# EAGLE design R2020Interface (EAGLE 6.3)
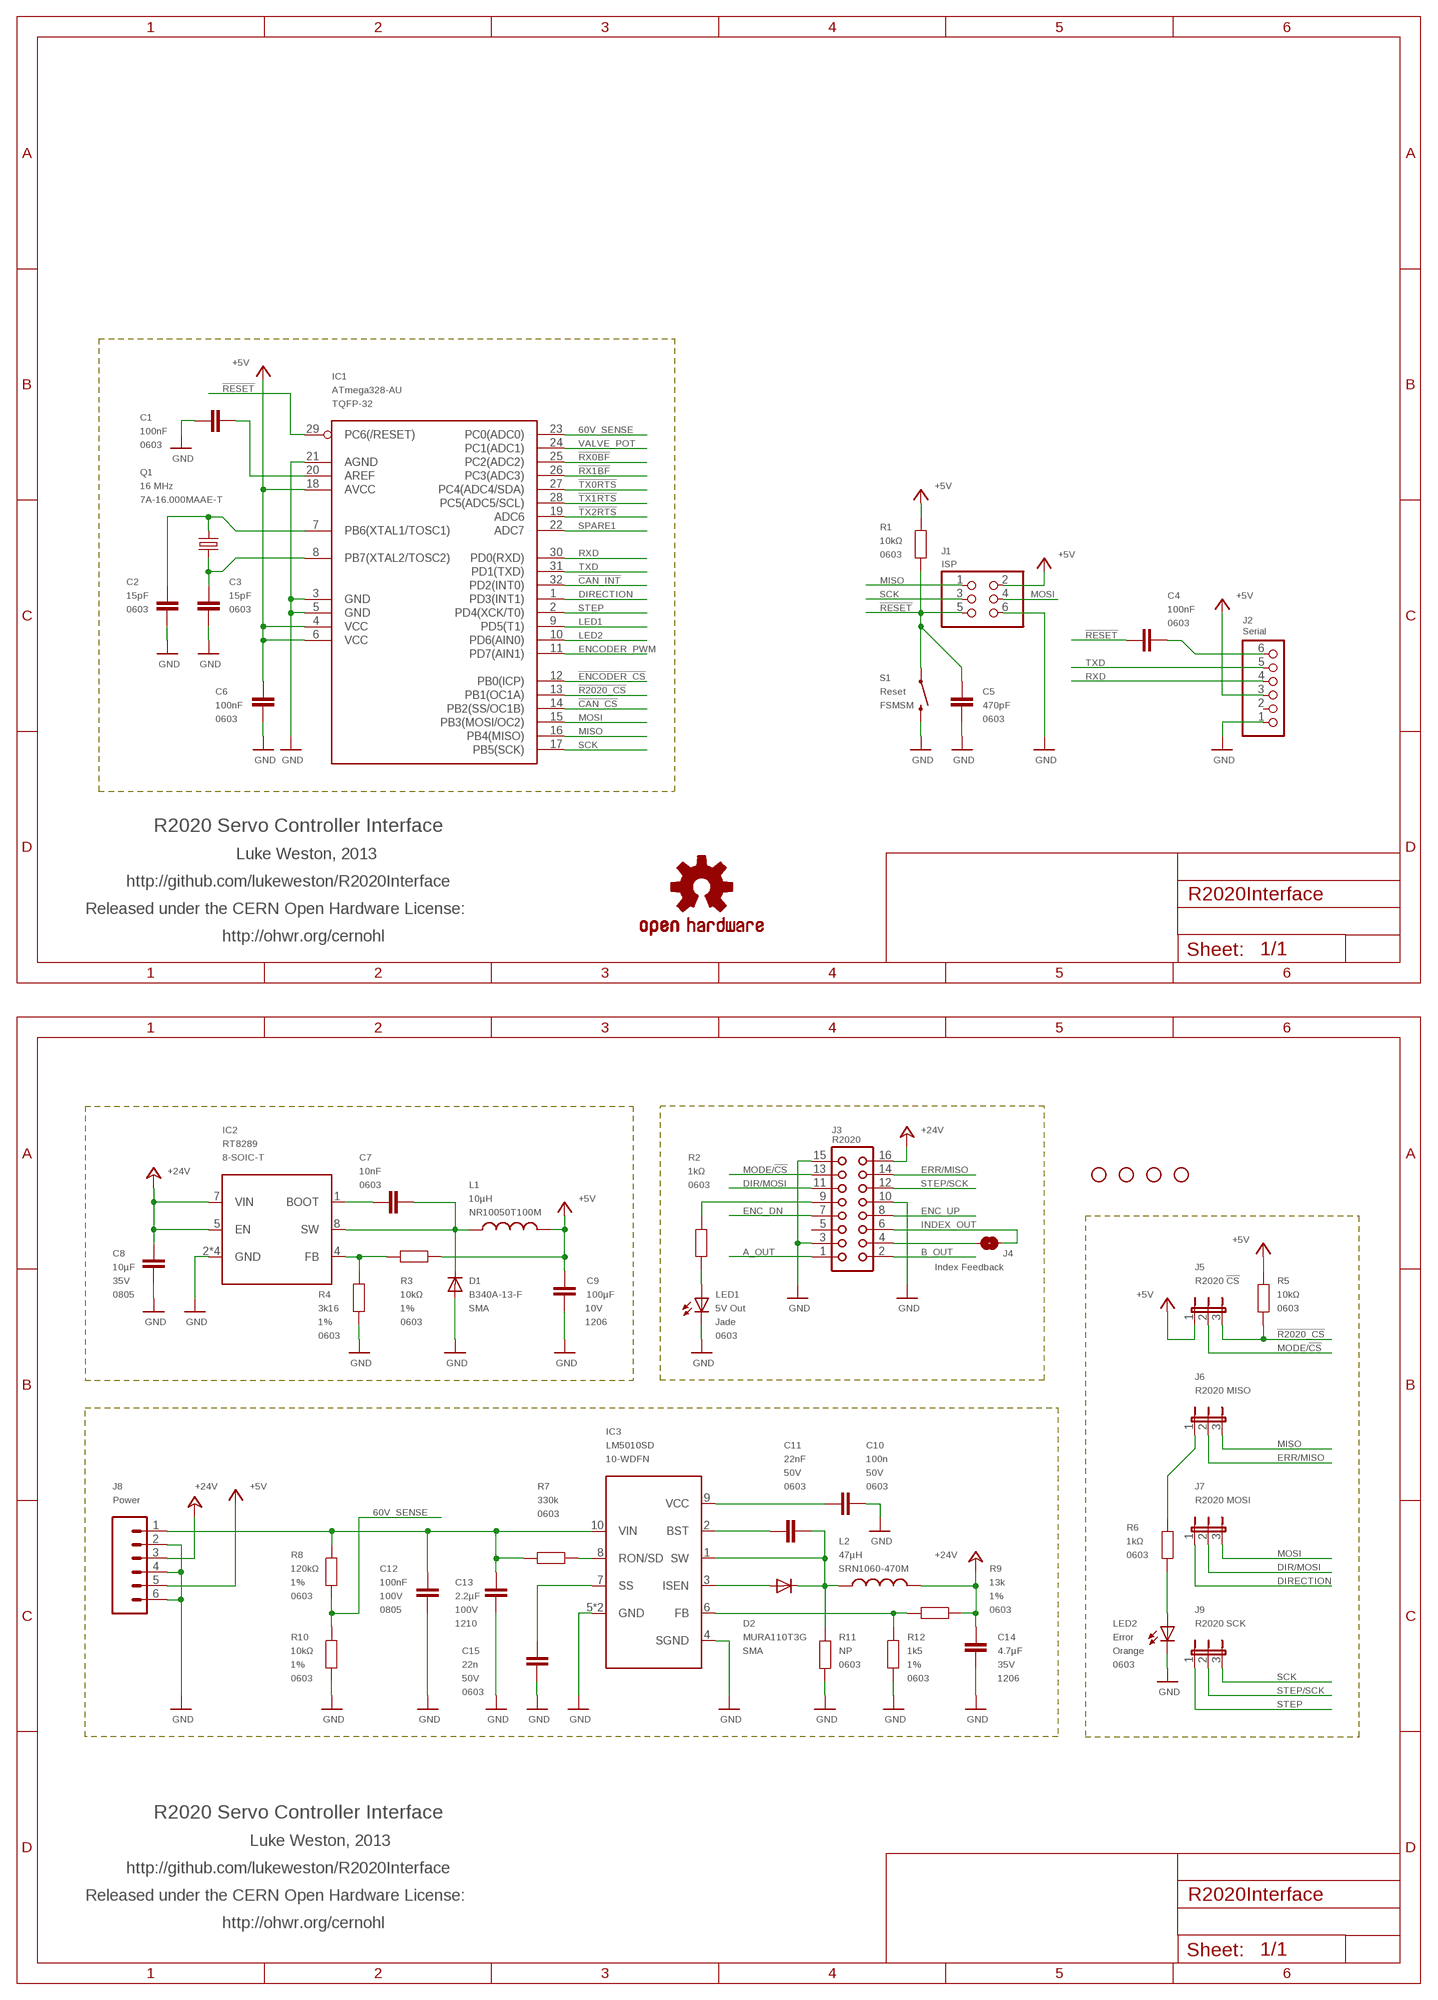
[diagram p0: schematic, sheet 1, part 1 of 2]
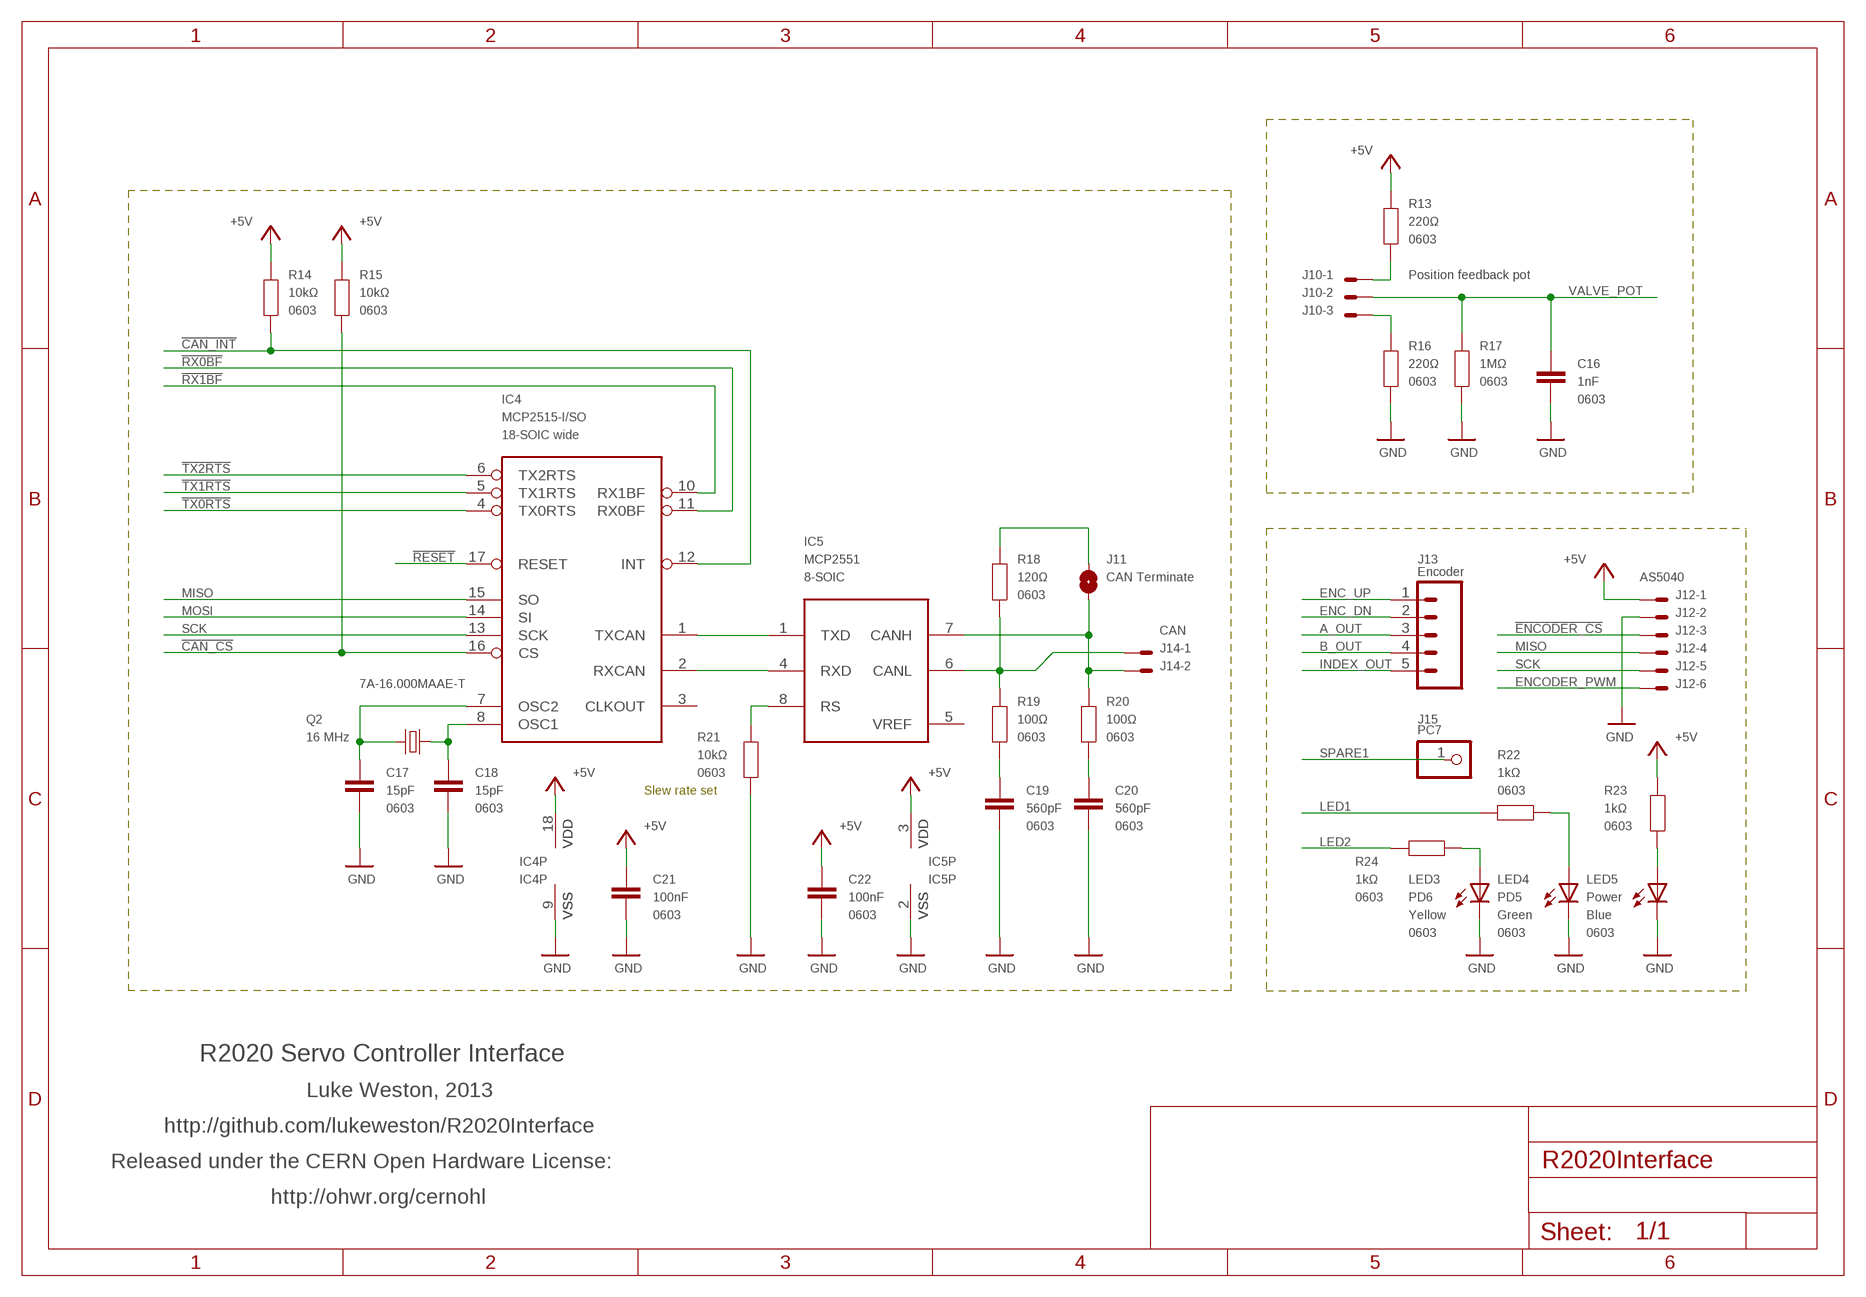
[diagram p1: schematic, sheet 1, part 2 of 2]

## Parts
C1  100nF  CAP0603  [0603]
C2  15pF  CAP0603  [0603]
C3  15pF  CAP0603  [0603]
C4  100nF  CAP0603  [0603]
C5  470pF  CAP0603  [0603]
C6  100nF  CAP0603  [0603]
C7  10nF  CAP0603  [0603]
C8  10µF  CAP0805  [0805]
C9  100µF  C-EUC1206K  [C1206K]
C10  100n  CAP0603  [0603]
C11  22nF  CAP0603  [0603]
C12  100nF  CAP0805  [0805]
C13  2.2µF  C-EUC1210K  [C1210K]
C14  4.7µF  C-EUC1206K  [C1206K]
C15  22n  CAP0603  [0603]
C16  1nF  CAP0603  [0603]
C17  15pF  CAP0603  [0603]
C18  15pF  CAP0603  [0603]
C19  560pF  CAP0603  [0603]
C20  560pF  CAP0603  [0603]
C21  100nF  CAP0603  [0603]
C22  100nF  CAP0603  [0603]
D1  B340A-13-F  DIODESMA  [SMA-DIODE]
D2  MURA110T3G  DIODESMA  [SMA-DIODE]
IC1  ATmega328-AU  AVR-MEGA8-AI  [TQFP32-08]
IC2  RT8289  [SO08T]
IC3  LM5010SD  LM5010  [10-WSON]
IC4  MCP2515-I/SO  MCP2510SO  [SO-18W]
IC5  MCP2551  MCP2551SN  [SO-08]
J1  ISP  PINHD-2X3  [2X03]
J2  Serial  PINHD-1X6  [1X06]
J3  R2020  CON16  [CON16]
J4  Index Feedback  SJ  [SJ]
J5  R2020 !CS  JP2E  [JP2]
J6  R2020 MISO  JP2E  [JP2]
J7  R2020 MOSI  JP2E  [JP2]
J8  Power  M06  [TERMINALBLOCK_3.5MM_6]
J9  R2020 SCK  JP2E  [JP2]
J10  Position feedback pot  22-05-7038-03  [7395-03]
J11  CAN Terminate  SJ  [SJ]
J12  AS5040  22-05-7068-06  [7395-06]
J13  Encoder  M05PTH  [1X05]
J14  CAN  22-05-7028-02  [7395-02]
J15  PC7  PINHD-1X1  [1X01]
JP1  STAND-OFF  [STAND-OFF]
JP2  STAND-OFF  [STAND-OFF]
JP3  STAND-OFF  [STAND-OFF]
JP4  STAND-OFF  [STAND-OFF]
L1  10µH  NR10050  [NR10050]
L2  47µH  SRN1060  [SRN1060]
LED1  5V Out  LED0603  [LED-0603]
LED2  Error  LED0603  [LED-0603]
LED3  PD6  LED0603  [LED-0603]
LED4  PD5  LED0603  [LED-0603]
LED5  Power  LED0603  [LED-0603]
Q1  16 MHz  CRYSTAL-2LEAD3.2X5  [CRYSTAL-3.2X5MM]
Q2  16 MHz  CRYSTAL-2LEAD3.2X5  [CRYSTAL-3.2X5MM]
R1  10kΩ  RESISTOR0603  [0603]
R2  1kΩ  RESISTOR0603  [0603]
R3  10kΩ  RESISTOR0603  [0603]
R4  3k16  RESISTOR0603  [0603]
R5  10kΩ  RESISTOR0603  [0603]
R6  1kΩ  RESISTOR0603  [0603]
R7  330k  RESISTOR0603  [0603]
R8  120kΩ  RESISTOR0603  [0603]
R9  13k  RESISTOR0603  [0603]
R10  10kΩ  RESISTOR0603  [0603]
R11  NP  RESISTOR0603  [0603]
R12  1k5  RESISTOR0603  [0603]
R13  220Ω  RESISTOR0603  [0603]
R14  10kΩ  RESISTOR0603  [0603]
R15  10kΩ  RESISTOR0603  [0603]
R16  220Ω  RESISTOR0603  [0603]
R17  1MΩ  RESISTOR0603  [0603]
R18  120Ω  RESISTOR0603  [0603]
R19  100Ω  RESISTOR0603  [0603]
R20  100Ω  RESISTOR0603  [0603]
R21  10kΩ  RESISTOR0603  [0603]
R22  1kΩ  RESISTOR0603  [0603]
R23  1kΩ  RESISTOR0603  [0603]
R24  1kΩ  RESISTOR0603  [0603]
S1  Reset  FSMSM  [FSMSM]
SY1  OSHW-LOGOS  [OSHW-LOGO-S]

## Nets
60V_SENSE: IC1.23(PC0(ADC0)) R8.1 R10.2
!CAN_CS: IC1.14(PB2(SS/OC1B)) IC4.16(CS) R15.2
!CAN_INT: IC1.32(PD2(INT0)) IC4.12(INT) R14.2
!ENCODER_CS: IC1.12(PB0(ICP)) J12.3
!R2020_CS: IC1.13(PB1(OC1A)) J5.3 R5.2
!RESET: C4.1 C5.2 IC1.29(PC6(/RESET)) IC4.17(RESET) J1.5 R1.1 S1.1
!RX0BF: IC1.25(PC2(ADC2)) IC4.11(RX0BF)
!RX1BF: IC1.26(PC3(ADC3)) IC4.10(RX1BF)
!TX0RTS: IC1.27(PC4(ADC4/SDA)) IC4.4(TX0RTS)
!TX1RTS: IC1.28(PC5(ADC5/SCL)) IC4.5(TX1RTS)
!TX2RTS: IC1.19(ADC6) IC4.6(TX2RTS)
+5V: C6.1 C9.1 C21.2 C22.2 IC1.4(VCC) IC1.6(VCC) IC1.18(AVCC) IC4.18(VDD) IC5.3(VDD) J1.2 J2.3 J5.1 J8.5 J12.1 L1.2 R1.2 R3.1 R5.1 R13.1 R14.1 R15.1 R23.1
+24V: C8.2 C14.1 IC2.5(EN) IC2.7(VIN) J3.16 J8.3 L2.2 R9.1
A_OUT: J3.1 J13.3
B_OUT: J3.2 J13.4
DIR/MOSI: J3.11 J7.2
DIRECTION: IC1.1(PD3(INT1)) J7.1
ENC_DN: J3.7 J13.2
ENC_UP: J3.8 J13.1
ENCODER_PWM: IC1.11(PD7(AIN1)) J12.6
ERR/MISO: J3.14 J6.2
GND: C1.2 C2.1 C3.1 C5.1 C6.2 C8.1 C9.2 C10.1 C12.1 C13.2 C14.2 C15.1 C16.1 C17.1 C18.1 C19.1 C20.1 C21.1 C22.1 D1.A IC1.3(GND) IC1.5(GND) IC1.21(AGND) IC2.2(GND) IC2.3(GND) IC2.6(GND) IC2.PAD(GND) IC3.4(SGND) IC3.5(GND) IC3.PAD(GND) IC4.9(VSS) IC5.2(VSS) J1.6 J2.1 J3.3 J3.10 J3.15 J8.2 J8.4 J8.6 J12.2 LED1.C LED2.C LED3.C LED4.C LED5.C R4.1 R10.1 R11.2 R12.1 R16.2 R17.2 R21.2 S1.2
INDEX_IN: J3.4 J4.2
INDEX_OUT: J3.6 J4.1 J13.5
LED1: IC1.9(PD5(T1)) R22.2
LED2: IC1.10(PD6(AIN0)) R24.2
MISO: IC1.16(PB4(MISO)) IC4.15(SO) J1.1 J6.3 J12.4
MODE/!CS: J3.13 J5.2
MOSI: IC1.15(PB3(MOSI/OC2)) IC4.14(SI) J1.4 J7.3
N$1: C1.1 IC1.20(AREF)
N$2: C2.2 IC1.7(PB6(XTAL1/TOSC1)) Q1.1
N$3: C3.2 IC1.8(PB7(XTAL2/TOSC2)) Q1.2
N$4: LED1.A R2.1
N$5: J3.9 R2.2
N$6: J10.1 R13.2
N$7: J6.1 R6.1
N$8: J11.2 R18.1
N$9: J10.3 R16.1
N$10: LED2.A R6.2
N$11: C7.1 D1.C IC2.8(SW) L1.1
N$12: IC5.7(CANH) J11.1 J14.2 R20.1
N$13: LED3.A R24.1
N$14: IC2.4(FB) R3.2 R4.2
N$15: LED4.A R22.1
N$16: C7.2 IC2.1(BOOT)
N$17: C11.1 D2.C IC3.1(SW) L2.1 R11.1
N$18: IC5.8(RS) R21.1
N$19: D2.A IC3.3(ISEN)
N$20: IC3.6(FB) R9.2 R12.2
N$21: C15.2 IC3.7(SS)
N$22: IC3.8(RON/SD) R7.1
N$23: IC4.2(RXCAN) IC5.4(RXD)
N$24: IC4.1(TXCAN) IC5.1(TXD)
N$25: C10.2 IC3.9(VCC)
N$26: C4.2 J2.6
N$27: C11.2 IC3.2(BST)
N$28: LED5.A R23.2
N$31: C19.2 R19.2
N$32: C20.2 R20.2
N$34: IC5.6(CANL) J14.1 R18.2 R19.1
N$36: C12.2 C13.1 IC3.10(VIN) J8.1 R7.2 R8.2
N$49: C18.2 IC4.8(OSC1) Q2.1
N$50: C17.2 IC4.7(OSC2) Q2.2
RXD: IC1.30(PD0(RXD)) J2.4
SCK: IC1.17(PB5(SCK)) IC4.13(SCK) J1.3 J9.3 J12.5
SPARE1: IC1.22(ADC7) J15.1
STEP: IC1.2(PD4(XCK/T0)) J9.1
STEP/SCK: J3.12 J9.2
TXD: IC1.31(PD1(TXD)) J2.5
VALVE_POT: C16.2 IC1.24(PC1(ADC1)) J10.2 R17.1
Unconnected: IC4.3(CLKOUT) J2.2 J3.5

## Notes on the sheet
- R2020 Servo Controller Interface
- Luke Weston, 2013
- http://github.com/lukeweston/R2020Interface
- Released under the CERN Open Hardware License:
- http://ohwr.org/cernohl
- R2020 Servo Controller Interface
- Luke Weston, 2013
- http://github.com/lukeweston/R2020Interface
- Released under the CERN Open Hardware License:
- http://ohwr.org/cernohl
- Slew rate set
- R2020 Servo Controller Interface
- Luke Weston, 2013
- http://github.com/lukeweston/R2020Interface
- Released under the CERN Open Hardware License:
- http://ohwr.org/cernohl

## Power pins joined to a net without a drawn wire
VREF: IC5.5(VREF)

## Library data of the parts
C1-C7 C16-C22 = freetronics-master-v1:CAP: Capacitor Standard 0603 ceramic capacitor, and 0.1" leaded capacitor.; PACKAGE: 0603
C8 = freetronics-master-v1:CAP: Capacitor Standard 0603 ceramic capacitor, and 0.1" leaded capacitor.; PACKAGE: 0805; VOLTAGE: 35V
C9 = rcl:C-EU: CAPACITOR, European symbol; PACKAGE: 1206; VOLTAGE: 10V
C10 C11 C15 = freetronics-master-v1:CAP: Capacitor Standard 0603 ceramic capacitor, and 0.1" leaded capacitor.; PACKAGE: 0603; VOLTAGE: 50V
C12 = freetronics-master-v1:CAP: Capacitor Standard 0603 ceramic capacitor, and 0.1" leaded capacitor.; PACKAGE: 0805; VOLTAGE: 100V
C13 = rcl:C-EU: CAPACITOR, European symbol; PACKAGE: 1210; VOLTAGE: 100V
C14 = rcl:C-EU: CAPACITOR, European symbol; PACKAGE: 1206; VOLTAGE: 35V
D1 D2 = freetronics-master-v1:DIODE: Diode These are standard reverse protection diodes and small signal diodes. SMA package can handle up to about 1A. SOD-323 can handle about 200mA. What the SOD-323 package when ordering, there are some mfgs out there that are 5-pin packages.; PACKAGE: SMA
IC1 = freetronics-master-v1:AVR-MEGA8: MICROCONTROLLER 8 Kbytes FLASH 1 kbytes SRAM 512 bytes EEPROM USART 6-channel 10 bit ADC 2-channel 8 bit ADC; PACKAGE: TQFP-32
IC2 = freetronics-luke:RT8289: RT8289 buck regulator; PACKAGE: 8-SOIC-T
IC3 = freetronics-luke:LM5010: Texas Instruments LM5010 high-voltage-input buck converter; PACKAGE: 10-WDFN
IC4 = microchip_can:MCP2510; PACKAGE: 18-SOIC wide
IC5 = microchip_can:MCP2551: High Speed CAN tranceiver; PACKAGE: 8-SOIC
J1 = pinhead:PINHD-2X3: PIN HEADER
J2 = pinhead:PINHD-1X6: PIN HEADER
J3 = con-harting:CON16: CONNECTOR; OC_FARNELL: unknown; OC_NEWARK: unknown
J4 J11 = freetronics-luke:SJ: PCB "solder jumper". Note that there should nothing on the BOM corresponding to this "component".
J5-J7 J9 = jumper:JP2E: JUMPER
J8 = freetronics-master-v1:M06: Header 6 Standard 6-pin 0.1" header. Use with straight break away headers (SKU : PRT-00116), right angle break away headers (PRT-00553), swiss pins (PRT-00743), machine pins (PRT-00117), and female headers (PRT-00115). Molex polarized connector foot print use with SKU : PRT-08094 with associated crimp pins and housings. NOTES ON THE VARIANTS LOCK and LOCK_LONGPADS... This footprint was designed to help hold the alignment of a through-hole component (i.e. 6-pin header) while soldering it into place. You may notice that each hole has been shifted either up or down by 0.005 of an inch from it's more standard position (which is a perfectly straight line). This slight alteration caused the pins (the squares in the middle) to touch the edges of the holes. Because they are alternating, it causes a "brace" to hold the component in place. 0.005 has proven to be the perfect amount of "off-center" position when using our standard breakaway headers. Although looks a little odd when you look at the bare footprint, once you have a header in there, the alteration is very hard to notice. Also, if you push a header all the way into place, it is covered up entirely on the bottom side. This idea of altering the position of holes to aid alignment will be further integrated into the Sparkfun Library for other footprints. It can help hold any component with 3 or more connection pins.
J10 = con-molex:22-?-03: CONNECTOR wire to board 2.54 mm (.1 inch) pitch header; OC_FARNELL: unknown; OC_NEWARK: unknown
J12 = con-molex:22-?-06: CONNECTOR wire to board 2.54 mm (.1 inch) pitch header; OC_FARNELL: unknown; OC_NEWARK: unknown
J13 = freetronics-master-v1:M05: Header 5 Standard 5-pin 0.1" header. Use with straight break away headers (SKU : PRT-00116), right angle break away headers (PRT-00553), swiss pins (PRT-00743), machine pins (PRT-00117), and female headers (PRT-00115). Molex polarized connector foot print use with SKU : PRT-08230 with associated crimp pins and housings.
J14 = con-molex:22-?-02: CONNECTOR wire to board 2.54 mm (.1 inch) pitch header; OC_FARNELL: 9731601; OC_NEWARK: unknown
J15 = pinhead:PINHD-1X1: PIN HEADER
JP1-JP4 = SparkFun:STAND-OFF: Stand Off This is the mechanical footprint for a #4 phillips button head screw. Use the keepout ring to avoid running the screw head into surrounding components. SKU : PRT-00447
L1 = freetronics-luke:NR10050: Taiyo Yuden NR10050 SMD power inductors; ID: NR10050T100M
L2 = freetronics-luke:SRN1060: Bourns SRN1060 series SMD power inductors; ID: SRN1060-470M
LED1 = freetronics-master-v1:LED: LEDs Standard schematic elements and footprints for 5mm, 3mm, 1206, and 0603 sized LEDs. 5mm - Spark Fun Electronics SKU : COM-00529 (and others); COLOR: Jade; PACKAGE: 0603
LED2 = freetronics-master-v1:LED: LEDs Standard schematic elements and footprints for 5mm, 3mm, 1206, and 0603 sized LEDs. 5mm - Spark Fun Electronics SKU : COM-00529 (and others); COLOR: Orange; PACKAGE: 0603
LED3 = freetronics-master-v1:LED: LEDs Standard schematic elements and footprints for 5mm, 3mm, 1206, and 0603 sized LEDs. 5mm - Spark Fun Electronics SKU : COM-00529 (and others); COLOR: Yellow; PACKAGE: 0603
LED4 = freetronics-master-v1:LED: LEDs Standard schematic elements and footprints for 5mm, 3mm, 1206, and 0603 sized LEDs. 5mm - Spark Fun Electronics SKU : COM-00529 (and others); COLOR: Green; PACKAGE: 0603
LED5 = freetronics-master-v1:LED: LEDs Standard schematic elements and footprints for 5mm, 3mm, 1206, and 0603 sized LEDs. 5mm - Spark Fun Electronics SKU : COM-00529 (and others); COLOR: Blue; PACKAGE: 0603
Q1 Q2 = freetronics-luke:CRYSTAL-2LEAD: 2-lead SMD crystal; ID: 7A-16.000MAAE-T
R1 R2 R5-R7 R11 R13-R24 = freetronics-master-v1:RESISTOR: Resistor Basic schematic elements and footprints for 0603, 1206, and PTH 1/10th watt (small) resistors.; PACKAGE: 0603
R3 R4 R8-R10 R12 = freetronics-master-v1:RESISTOR: Resistor Basic schematic elements and footprints for 0603, 1206, and PTH 1/10th watt (small) resistors.; PACKAGE: 0603; TOLERANCE: 1%
S1 = freetronics-luke:FSMSM: Tyco FSMSM 2-pin SMD small tactile button; PACKAGE: FSMSM
SY1 = SparkFun:OSHW-LOGO: Open Source Hardware Logo This logo indicates the piece of hardware it is found on incorporates a OSHW license and/or adheres to the definition of open source hardware found here: http://freedomdefined.org/OSHW

## Net classes
0 default: width 0.152 mm, drill 0.241 mm, clearance 0.152 mm

## Board
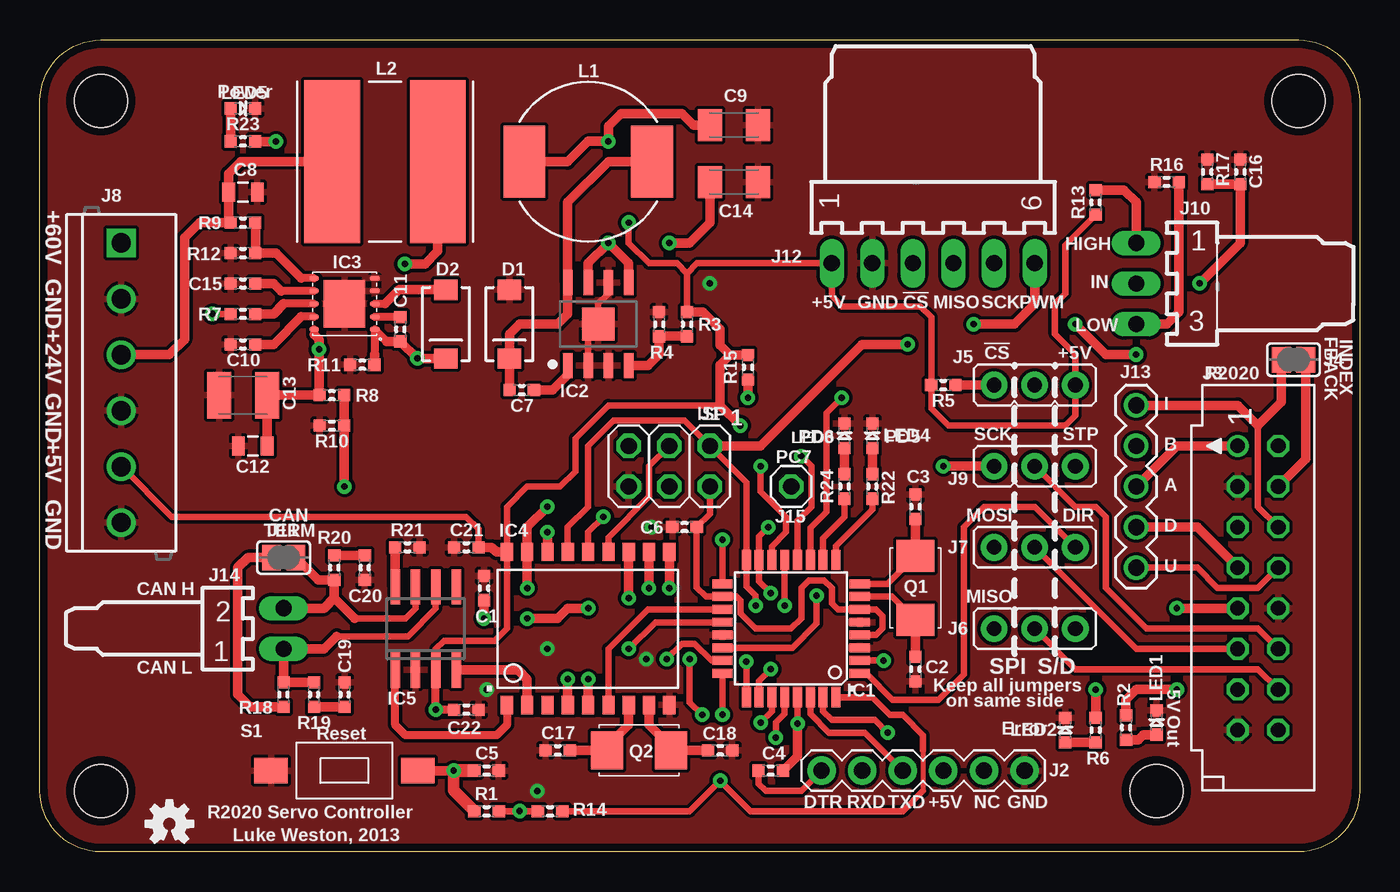
[diagram p2: board, top side]
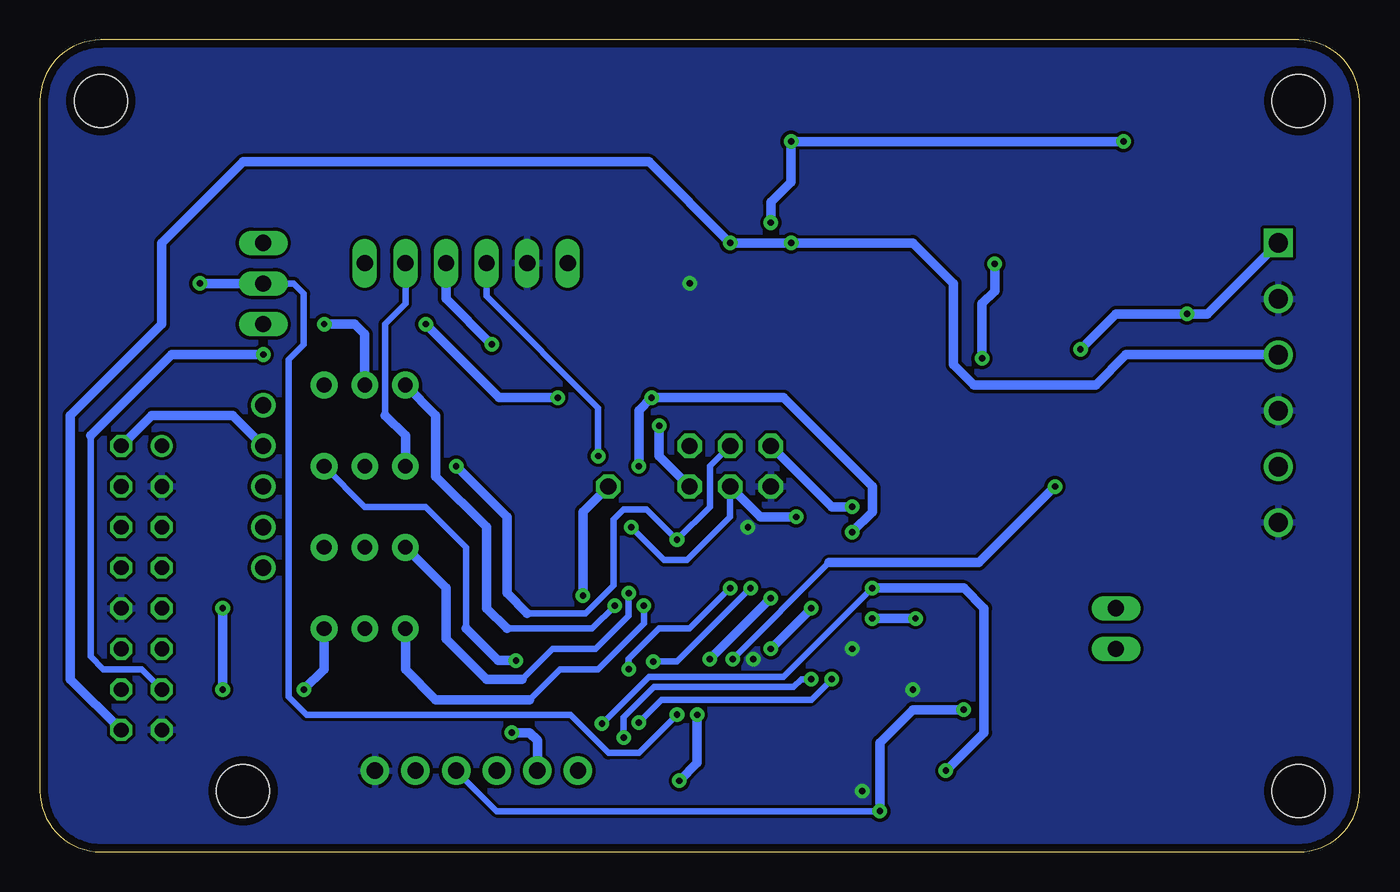
[diagram p3: board, bottom side, seen from below]

Size 82.55 x 50.8 mm. Coordinates in mm from the lower left corner, seen from the top.
Outline: 0,46.99 arc-90 3.81,50.8 78.74,50.8 arc-90 82.55,46.99 82.55,3.81 arc-90 78.74,0 3.81,0 arc-90 0,3.81 0,46.99
Copper layers (1*16): Top 0.035mm / dielectric 1.5mm / Bottom 0.035mm
Design rules "PCBCart-Standard *": minimum track width 8mil, minimum drill 0.4mm, track to track 8mil, track to pad 8mil, pad to pad 8mil, via to via 8mil, smd to smd 8mil, copper to edge 20mil, drill to drill 8mil, minimum pad ring 8mil, minimum via ring 10mil, stop-mask expansion 3mil, vias tented up to drill 16mil, thermal gap 8mil

### Footprints (pad centres in the part's own frame; a part is rotated, then mirrored left to right if it is on the bottom)
0603 = smd 0.762 x 0.762: 1 -0.762,0; 2 0.762,0
0805 = smd 0.8 x 1.2: 1 -0.9,0; 2 0.9,0
C1206K = smd 1.5 x 2: 1 -1.5,0; 2 1.5,0
C1210K = smd 1.5 x 2.9: 1 -1.5,0; 2 1.5,0
SMA-DIODE = smd 1.27 x 1.47: A -2.15,0; C 2.15,0
TQFP32-08 = smd 1.27 x 0.559: 1 -4.293,2.8; 2 -4.293,2; 3 -4.293,1.2; 4 -4.293,0.4; 5 -4.293,-0.4; 6 -4.293,-1.2; 7 -4.293,-2; 8 -4.293,-2.8; 17 4.293,-2.8; 18 4.293,-2; 19 4.293,-1.2; 20 4.293,-0.4; 21 4.293,0.4; 22 4.293,1.2; 23 4.293,2; 24 4.293,2.8 | smd 0.559 x 1.27: 9 -2.8,-4.293; 10 -2,-4.293; 11 -1.2,-4.293; 12 -0.4,-4.293; 13 0.4,-4.293; 14 1.2,-4.293; 15 2,-4.293; 16 2.8,-4.293; 25 2.8,4.293; 26 2,4.293; 27 1.2,4.293; 28 0.4,4.293; 29 -0.4,4.293; 30 -1.2,4.293; 31 -2,4.293; 32 -2.8,4.293
SO08T = smd 0.6 x 1.575: 1 -1.905,-2.6; 2 -0.635,-2.6; 3 0.635,-2.6; 4 1.905,-2.6; 5 1.905,2.6; 6 0.635,2.6; 7 -0.635,2.6; 8 -1.905,2.6 | smd 2.057 x 2.057: PAD 0,0
10-WSON = smd 0.3 x 0.6: 1 -1.6,-1.9; 2 -0.8,-1.9; 3 0,-1.9; 4 0.8,-1.9; 5 1.6,-1.9; 6 1.6,1.9; 7 0.8,1.9; 8 0,1.9; 9 -0.8,1.9; 10 -1.6,1.9 | smd 3 x 2.6: PAD 0,0
SO-18W = smd 0.762 x 1.143: 1 -5.08,-4.788; 2 -3.81,-4.788; 3 -2.54,-4.788; 4 -1.27,-4.788; 5 0,-4.788; 6 1.27,-4.788; 7 2.54,-4.788; 8 3.81,-4.788; 9 5.08,-4.788; 10 5.08,4.788; 11 3.81,4.788; 12 2.54,4.788; 13 1.27,4.788; 14 0,4.788; 15 -1.27,4.788; 16 -2.54,4.788; 17 -3.81,4.788; 18 -5.08,4.788
SO-08 = smd 0.6 x 2.2: 1 -1.905,-2.6; 2 -0.635,-2.6; 3 0.635,-2.6; 4 1.905,-2.6; 5 1.905,2.6; 6 0.635,2.6; 7 -0.635,2.6; 8 -1.905,2.6
2X03 = drill 1.016 octagon: 1 -2.54,-1.27; 2 -2.54,1.27; 3 0,-1.27; 4 0,1.27; 5 2.54,-1.27; 6 2.54,1.27
1X06 = drill 1.016 pad 1.778: 1 -6.35,0; 2 -3.81,0; 3 -1.27,0; 4 1.27,0; 5 3.81,0; 6 6.35,0
CON16 = drill 0.914: 1 -8.89,-1.27 | drill 0.914 octagon: 2 -8.89,1.27; 3 -6.35,-1.27; 4 -6.35,1.27; 5 -3.81,-1.27; 6 -3.81,1.27; 7 -1.27,-1.27; 8 -1.27,1.27; 9 1.27,-1.27; 10 1.27,1.27; 11 3.81,-1.27; 12 3.81,1.27; 13 6.35,-1.27; 14 6.35,1.27; 15 8.89,-1.27; 16 8.89,1.27
SJ = smd 1.168 x 1.6: 1 -0.762,0; 2 0.762,0
JP2 = drill 0.914 pad 1.676: 1 -2.54,0; 2 0,0; 3 2.54,0
TERMINALBLOCK_3.5MM_6 = drill 1.2 square: 1 0,0 | drill 1.2: 2 3.5,0; 3 7,0; 4 10.5,0; 5 14,0; 6 17.5,0
7395-03 = drill 1.016 long: 1 2.54,0; 2 0,0; 3 -2.54,0
7395-06 = drill 1.016 long: 1 6.35,0; 2 3.81,0; 3 1.27,0; 4 -1.27,0; 5 -3.81,0; 6 -6.35,0
1X05 = drill 1.016: 1 0,0; 2 2.54,0; 3 5.08,0; 4 7.62,0; 5 10.16,0
7395-02 = drill 1.016 long: 1 1.27,0; 2 -1.27,0
1X01 = drill 1.016 octagon: 1 0,0
STAND-OFF = hole 3.302: 0,0
NR10050 = smd 2.6 x 4.5: 1 -4,0; 2 4,0
SRN1060 = smd 3.5 x 10.2: 1 -3.3,0; 2 3.3,0
LED-0603 = smd 0.762 x 0.762: A -0.762,0; C 0.762,0
CRYSTAL-3.2X5MM = smd 2 x 2.4: 1 -2,0; 2 2,0
FSMSM = smd 2.108 x 1.6: 1 -4.597,0; 2 4.597,0

### Placement (x,y rotation side)
C1  27.78,16.51 90 top
C2  54.77,11.43 90 top
C3  54.77,21.59 270 top
C4  45.72,5.08 180 top
C5  27.94,5.08 180 top
C6  40.32,20.32 180 top
C7  30.13,28.89 0 top
C8  12.7,41.27 180 top
C9  43.41,45.47 0 top
C10  12.7,31.75 0 top
C11  22.54,32.7 90 top
C12  13.31,25.4 0 top
C13  12.7,28.57 180 top
C14  43.41,41.91 0 top
C15  12.7,35.56 0 top
C16  75.09,42.55 270 top
C17  32.38,6.35 0 top
C18  42.54,6.35 180 top
C19  19.05,9.84 270 top
C20  20.32,17.78 90 top
C21  26.67,19.05 0 top
C22  26.67,8.89 180 top
D1  29.37,33.02 270 top
D2  25.4,33.02 270 top
IC1  46.99,13.97 180 top
IC2  34.92,33.02 0 top
IC3  19.05,34.29 90 top
IC4  34.29,13.97 0 top
IC5  24.13,13.97 0 top
J1  39.37,24.13 180 top
J2  55.24,5.08 180 top
J3  76.2,16.51 270 top
J4  78.42,30.8 0 top
J5  62.23,29.21 180 top
J6  62.23,13.97 180 top
J7  62.23,19.05 180 top
J8  5.08,38.1 270 top
J9  62.23,24.13 180 top
J10  68.58,35.56 90 top
J11  15.24,18.41 180 top
J12  55.88,36.83 180 top
J13  68.58,17.78 90 top
J14  15.24,13.97 270 top
J15  46.99,22.86 0 top
JP1  78.74,46.99 0 top
JP2  69.85,3.81 0 top
JP3  3.81,46.99 0 top
JP4  3.81,3.81 0 top
L1  34.29,43.18 180 top
L2  21.59,43.18 180 top
LED1  69.85,8.1 90 top
LED2  64.14,7.62 90 top
LED3  50.32,26.04 90 top
LED4  52.07,26.04 90 top
LED5  12.7,46.51 0 top
Q1  54.77,16.51 90 top
Q2  37.46,6.35 180 top
R1  27.94,2.54 0 top
R2  67.95,7.78 90 top
R3  40.48,33.02 270 top
R4  38.73,33.02 270 top
R5  56.51,29.21 0 top
R6  66.04,7.62 270 top
R7  12.7,33.66 180 top
R8  18.26,28.57 180 top
R9  12.7,39.37 0 top
R10  18.26,26.67 0 top
R11  20.16,30.48 180 top
R12  12.7,37.47 0 top
R13  66.04,40.64 90 top
R14  31.91,2.54 0 top
R15  44.29,30.32 270 top
R16  70.48,41.91 180 top
R17  73.03,42.55 90 top
R18  15.24,9.84 90 top
R19  17.14,9.84 270 top
R20  18.41,17.78 90 top
R21  22.99,19.05 0 top
R22  52.07,22.86 270 top
R23  12.7,44.45 180 top
R24  50.32,22.86 270 top
S1  19.05,5.08 180 top
SY1  8.1,1.75 0 top

### Tracks (layer width: path | path; a pad name or v marks a point on that pad's centre or on a via)
60V_SENSE  (via drill 0.4)
  Top 0.406: IC1.23 42,11.97 40.96,13.02 40.16,13.02 v39.21,12.06 | 19.02,22.89 v19.05,22.86
  Top 0.61: R8.1 R10.2 19.02,22.89
  Bottom 0.406: v39.21,12.06 33.18,18.1
  Bottom 0.61: 33.18,18.1 23.81,18.1 v19.05,22.86
!CAN_CS  (via drill 0.4)
  Top 0.406: IC1.14 45.79,19.12 46.67,20 46.67,20.95 45.08,22.54 v45.08,24.13
  Top 0.61: v31.75,20 IC4.16 | R15.2 v44.29,28.42
  Bottom 0.61: v31.75,20 30.48,21.27 30.48,22.86 36.04,28.42 v44.29,28.42 45.08,27.62 v45.08,24.13
!CAN_INT  (via drill 0.4)
  Top 0.305: 55.24,6.35 55.24,3.81
  Top 0.406: v40.64,12.06 40.64,9.37 v41.43,8.57 | 55.24,3.81 53.97,2.54 44.45,2.54 v42.54,4.45 40.64,2.54 R14.2 | IC1.32 52.08,9.68 53.18,8.57 53.97,8.57 55.24,7.3 55.24,6.35
  Top 0.61: IC4.12 v36.83,15.88
  Bottom 0.61: v36.83,15.88 v40.64,12.06 | v41.43,8.57 41.43,5.56 v42.54,4.45
!ENCODER_CS  (via drill 0.4)
  Top 0.406: IC1.12 47.39,20.72 48.26,21.59 48.26,24.13 v47.62,24.77
  Bottom 0.406: v47.62,24.77 47.62,27.78 54.61,34.77 J12.3
!R2020_CS  (via drill 0.4)
  Top 0.406: IC1.13 v46.59,15.4
  Top 0.61: R5.2 J5.3
  Bottom 0.406: 53.34,13.97 48.02,13.97 v46.59,15.4
  Bottom 0.61: J5.3 57.78,27.3 57.78,23.5 54.61,20.32 54.61,15.24 53.34,13.97
!RESET  (via drill 0.4)
  Top 0.406: IC1.29 v47.39,8.01
  Top 0.61: C4.1 47.39,5.99 v47.39,8.01 | v30.48,16.51 IC4.17 30.48,20.32 v31.75,21.59 | S1.1 v25.88,5.08
  Top 0.711: v25.88,5.08 25.88,3.84 R1.1
  Top 0.813: C5.2 v25.88,5.08
  Bottom 0.406: v47.39,8.01 44.45,10.95 36.04,10.95 v30.48,16.51
  Bottom 0.61: v31.75,21.59 33.02,21.59 J1.5 | v25.88,5.08 23.5,7.46 23.5,15.24 24.77,16.51 v30.48,16.51
!RX0BF  (via drill 0.4)
  Top 0.406: IC1.25 v44.19,11.91
  Top 0.61: v38.1,16.51 IC4.11
  Bottom 0.406: v38.1,16.51 41.91,12.7 42.7,11.91 v44.19,11.91
!RX1BF  (via drill 0.4)
  Top 0.406: IC1.26 44.99,10.7 v45.72,11.43
  Top 0.61: v39.37,16.51 IC4.10
  Bottom 0.406: v39.37,16.51 41.91,13.97 43.81,13.97 45.72,12.06 v45.72,11.43
!TX0RTS  (via drill 0.4)
  Top 0.406: IC1.27 45.79,8.8 v45.08,8.1
  Top 0.61: IC4.4 v33.02,10.79
  Bottom 0.406: v45.08,8.1 43.66,9.53 34.29,9.53 v33.02,10.79
!TX1RTS  (via drill 0.4)
  Top 0.406: v46.04,7.14 46.04,8.1 46.59,8.65 IC1.28
  Top 0.61: IC4.5 v34.29,10.79
  Bottom 0.406: v46.04,7.14 46.04,8.41 44.13,10.32 35.4,10.32 34.92,10.79 v34.29,10.79
!TX2RTS
  Top 0.406: IC1.19 38.03,15.17 35.56,12.7 IC4.6
+5V  (via drill 0.4)
  Top 0.406: IC5.3 24.77,12.7 25.27,13.21 28.45,13.21 29.21,13.97 IC4.18 29.21,21.59 30.48,22.86 32.54,22.86 33.5,23.81 33.5,25.88 35.56,27.94 42.54,27.94 | IC1.4 52.3,13.57 52.7,13.97 52.7,14.76 52.3,15.17 IC1.6 49.92,15.17 49.53,15.56 49.53,16.51 49.05,16.99 48.1,16.99 47.62,16.51 47.62,14.61 46.99,13.97 44.77,13.97 43.81,14.92 43.81,15.72 43.56,15.97 IC1.18 41.66,15.97 41.08,16.54 C6.1 41.91,21.14 J1.2 | J8.5 5.11,24.1 8.26,20.95 26.67,20.95 27.43,20.19 C21.2 | v36.83,39.37 36.83,38.1 38.1,36.83 39.85,36.83 40.48,36.2 | v35.56,44.45 | R1.2 v30,2.54 R14.1 | R3.1 40.48,36.2 | 40.48,36.2 41.12,36.83 J12.1 49.53,34.77 50.16,34.13 55.09,34.13 55.75,33.47 R5.1 55.75,27.75 56.83,26.67 64.14,26.67 64.77,27.3 J5.1 64.77,31.11 63.5,32.38 63.5,34.29 64.14,34.92 64.14,37.97 R13.1
  Top 0.508: IC5.3 v24.77,8.89 C22.2
  Top 0.61: C9.1 40.89,45.47 40.16,46.2 36.35,46.2 35.56,45.4 v35.56,44.45 34.29,44.45 33.02,43.18 L1.2 | v43.81,26.67 42.54,27.94 42.54,30.45 43.18,31.08 | R3.1 41.47,33.78 42.54,32.7 42.54,31.72 43.18,31.08 | C21.2 28.26,19.05 28.55,18.76 IC4.18 | R15.1 43.18,31.08 | R23.1 v14.76,44.45
  Bottom 0.406: J2.3 53.97,2.54 v30,2.54
  Bottom 0.61: v43.81,26.67 43.81,24.77 J1.2 | v36.83,39.37 36.83,40.64 35.56,41.91 v35.56,44.45 v14.76,44.45 | v30,2.54 30,6.83 27.94,8.89 v24.77,8.89
+24V  (via drill 0.4)
  Top 0.61: IC2.7 34.29,36.83 v35.56,38.1 36.83,36.83 IC2.5 | J8.3 8.08,31.1 9.05,32.07 9.05,38.42 10,39.37 R9.1 11.8,39.51 C8.2 11.8,42.44 12.54,43.18 L2.2 | C14.1 41.91,39.37 40.64,38.1 v39.37,38.1
  Bottom 0.61: J8.3 14.62,31.1 16.51,29.21 24.13,29.21 25.4,30.48 25.4,35.56 27.94,38.1 v35.56,38.1 v39.37,38.1 44.45,43.18 69.85,43.18 74.93,38.1 74.93,33.02 80.65,27.3 80.65,10.79 J3.16
A_OUT
  Top 0.61: J3.1 71.12,25.4 J13.3
B_OUT
  Bottom 0.61: J13.4 70.48,27.3 75.56,27.3 J3.2
DIR/MOSI
  Top 0.406: J3.11 68.58,12.7 J7.2
DIRECTION
  Top 0.406: J7.1 62.23,21.59 59.05,21.59 57.78,20.32 57.78,11.11 56.2,9.53 53.34,9.53 51.7,11.17 IC1.1
ENC_DN
  Top 0.61: J13.2 72.39,20.32 J3.7
ENC_UP
  Top 0.406: J3.8 76.2,16.51 73.66,16.51 72.39,17.78 J13.1
ENCODER_PWM  (via drill 0.4)
  Top 0.406: IC1.11 48.19,20.25 49.21,21.27 49.21,27.46 v50.16,28.42
  Top 0.61: v58.42,33.02 60.96,33.02 62.23,34.29 J12.6
  Bottom 0.61: v50.16,28.42 53.82,28.42 v58.42,33.02
ERR/MISO
  Top 0.406: J3.14 76.2,11.43 64.77,11.43 J6.2
GND  (via drill 0.4)
  Top 0.406: IC2.6 35.56,34.92 34.92,34.29 IC2.PAD 34.29,32.38 IC2.2
  other vias: 38.26,20.32 37.94,12.06 27.94,10.16 31.11,3.81 31.75,12.7 41.91,35.56
  pour Top: -1.27,52.07 83.82,52.07 83.82,-1.27 -1.27,-1.27
  pour Bottom: -1.27,52.07 83.82,52.07 83.82,-1.27 -1.27,-1.27
INDEX_IN
  Top 0.61: J4.2 79.18,24.57 J3.4
INDEX_OUT
  Top 0.406: J3.6 76.2,21.59 76.2,26.67
  Top 0.61: J13.5 74.93,27.94 76.2,26.67 77.66,28.13 J4.1
LED1
  Top 0.406: IC1.9 49.79,19.15 52.07,21.43 R22.2
LED2
  Top 0.406: IC1.10 48.99,19.62 50.32,20.95 R24.2
MISO  (via drill 0.4)
  Top 0.406: IC4.15 33.02,20.32 34.29,21.59 34.29,25.4 35.88,26.99 40.32,26.99 J1.1 44.19,23.12 IC1.16 44.19,16.61 44.77,16.03 v44.77,15.4
  Top 0.61: J1.1 45.08,25.4 51.43,31.75 v54.29,31.75
  Bottom 0.406: v44.77,15.4 44.77,14.29 47.62,11.43 50.01,11.43 51.91,9.53
  Bottom 0.61: 51.91,9.53 57.78,9.53 59.69,11.43 J6.3 | v54.29,31.75 57.15,34.61 J12.4
MODE/!CS  (via drill 0.4)
  Top 0.61: v68.58,31.11 66.67,31.11 v64.77,33.02
  Bottom 0.406: J3.13 76.2,11.43 78.58,11.43 79.38,12.22 79.38,26.04
  Bottom 0.61: 79.38,26.04 74.3,31.11 v68.58,31.11 | v64.77,33.02 62.87,33.02 62.23,32.38 J5.2
MOSI  (via drill 0.4)
  Top 0.406: IC4.14 34.29,20 v35.24,20.95 | v45.56,20.32 44.99,19.75 IC1.15 44.99,16.92 v45.72,16.19
  Bottom 0.406: v45.56,20.32 43.5,18.26 42.07,18.26 39.37,20.95 J1.4 | v45.72,16.19 45.72,14.76 47.78,12.7 50.48,12.7 52.39,10.79
  Bottom 0.61: 52.39,10.79 54.61,10.79 57.15,13.34 57.15,16.51 J7.3 | v35.24,20.95 37.46,20.95 J1.4
N$1  (via drill 0.4)
  Top 0.406: IC1.20 38.5,14.37 v36.83,12.7
  Top 0.61: C1.1 v27.78,14.61 | v30.48,14.61 32.38,14.61 33.02,15.24 v34.29,15.24
  Bottom 0.61: v27.78,14.61 v30.48,14.61 | v36.83,12.7 v34.29,15.24
N$2
  Top 0.406: IC1.7 53.31,15.97 Q1.1
  Top 0.61: C2.2 Q1.1
N$3
  Top 0.406: IC1.8 53.03,16.77 Q1.2
  Top 0.61: C3.2 Q1.2
N$4
  Top 0.61: LED1.A 69.02,7.33 68.71,7.02 R2.1
N$5  (via drill 0.4)
  Top 0.61: J3.9 v71.12,15.24 | R2.2 67.95,9.53 68.58,10.16 v71.12,10.16
  Bottom 0.61: v71.12,15.24 v71.12,10.16
N$6
  Top 0.61: R13.2 67.82,41.4 68.58,40.64 J10.1
N$7  (via drill 0.4)
  Top 0.61: R6.1 v66.04,10.16
  Bottom 0.61: v66.04,10.16 64.77,11.43 J6.1
N$8
  Top 0.61: J11.2 13.02,18.41 12.38,17.78 12.38,9.84 13.14,9.08 R18.1
N$9
  Top 0.61: R16.1 71.25,33.78 70.48,33.02 J10.3
N$10
  Top 0.61: LED2.A R6.2
N$11
  Top 0.406: C7.1
  Top 0.61: C7.1 D1.C 29.37,32.38 30,33.02 32.38,33.02 33.02,33.66 IC2.8 33.02,40.64 35.56,43.18 L1.1
N$12
  Top 0.406: IC5.7 23.5,15.24 22.86,14.61 19.68,14.61
  Top 0.61: J14.2 17.78,15.24 18.41,15.88 | 19.68,14.61 18.41,15.88 | J11.1 17.4,17.02 R20.1 18.41,15.88
N$13
  Top 0.61: LED3.A R24.1
N$14
  Top 0.61: IC2.4 38.04,30.42 38.73,31.11 R4.2 R3.2
N$15
  Top 0.61: LED4.A R22.1
N$16
  Top 0.406: 33.02,29.84 IC2.1
  Top 0.61: C7.2 32.07,28.89 33.02,29.84
N$17  (via drill 0.4)
  Top 0.508: 21.7,31.94 IC3.1 20.95,31.14
  Top 0.61: 21.7,31.94 C11.1 v23.61,30.87 D2.C | 20.95,31.14 R11.1 | v22.82,36.79 24.09,36.79 24.89,37.59 L2.1
  Bottom 0.61: v23.61,30.87 23.61,34.29 22.82,35.08 v22.82,36.79
N$18
  Top 0.61: IC5.8 R21.1
N$19
  Top 0.508: IC3.3 21.59,34.29
  Top 0.61: 21.59,34.29 22.47,35.17 D2.A
N$20
  Top 0.406: 13.49,37.5 R12.2 | 13.49,39.34 R9.2
  Top 0.508: IC3.6 16.34,35.89
  Top 0.61: 16.34,35.89 14.76,37.47 R12.2 | 13.49,37.5 13.49,39.34
N$21
  Top 0.508: IC3.7 15.07,35.09
  Top 0.61: 15.07,35.09 14.61,35.56 C15.2
N$22
  Top 0.508: IC3.8 15.24,34.29
  Top 0.61: 15.24,34.29 14.61,33.66 R7.1
N$23
  Top 0.61: IC5.4 29.91,11.37 30.48,10.79 IC4.2
N$24
  Top 0.508: IC4.1 29.21,7.94 28.57,7.3 22.86,7.3 22.23,7.94 IC5.1
N$25
  Top 0.508: IC3.9 16.34,33.49
  Top 0.61: 16.34,33.49 14.61,31.75 C10.2
N$26
  Top 0.406: C4.2 44.96,4.25 45.4,3.81 47.62,3.81 J2.6
N$27
  Top 0.508: IC3.2 22.52,33.49
  Top 0.61: 22.52,33.49 C11.2
N$28
  Top 0.61: R23.2 LED5.A
N$31
  Top 0.61: C19.2 R19.2
N$32
  Top 0.61: C20.2 R20.2
N$34
  Top 0.406: 18.57,13.49 23.02,13.49 24.77,15.24 IC5.6
  Top 0.61: 18.57,13.49 17.78,12.7 J14.1 R18.2 R19.1
N$36  (via drill 0.4)
  Top 0.406: v10.79,33.66 R7.2 | 17.46,28.61 R8.2 | C12.2
  Top 0.508: IC3.10 17.15,32.38
  Top 0.61: 17.15,32.38 17.46,32.07 v17.46,31.43 17.46,28.61 | R8.2 C13.1 C12.2
  Bottom 0.61: v17.46,31.43 15.24,33.66 v10.79,33.66 9.53,33.66 J8.1
N$49
  Top 0.406: Q2.1 39.46,6.57
  Top 0.61: 39.46,6.57 38.1,7.94 IC4.8 | C18.2 Q2.1
N$50
  Top 0.406: Q2.2 35.46,6.57
  Top 0.61: 35.46,6.57 36.83,7.94 IC4.7 | C17.2 Q2.2
RXD
  Top 0.406: IC1.30 48.19,8.64 49.37,7.46 51.59,7.46 J2.4
SCK  (via drill 0.4)
  Top 0.406: v42.7,19.53 IC1.17 | IC4.13 35.56,19.68 38.1,22.23 38.1,24.13 J1.3
  Top 0.61: J9.3 v56.51,24.13
  Bottom 0.406: J1.3 40.64,24.13 40.64,21.59 v42.7,19.53 v42.7,19.54 42.72,19.54 44.61,21.43 46.04,21.43 46.67,20.8 46.67,16.67 48.42,14.92 52.07,14.92 | 60.96,27.3 60.96,33.02 59.69,34.29 J12.5
  Bottom 0.61: 52.07,14.92 53.34,16.19 53.34,20.95 v56.51,24.13 | J9.3 59.69,26.04 60.96,27.3
SPARE1  (via drill 0.4)
  Top 0.406: IC1.22 47.06,12.77 48.58,14.29 v48.58,16.03
  Bottom 0.61: v48.58,16.03 48.58,21.27 J15.1
STEP  (via drill 0.4)
  Top 0.406: IC1.2 v52.77,11.97
  Bottom 0.406: 55.88,13.97 55.88,19.05 58.42,21.59 62.23,21.59 J9.1
  Bottom 0.61: v52.77,11.97 53.88,11.97 55.88,13.97
STEP/SCK
  Top 0.406: J3.12 76.2,13.97 69.22,13.97 66.67,16.51 66.67,20.95 66.04,21.59 64.77,21.59 J9.2
TXD  (via drill 0.4)
  Top 0.406: IC1.31 48.99,8.79 49.53,8.26 52.23,8.26 v53.02,7.46
  Bottom 0.61: v53.02,7.46 51.91,7.46 51.43,6.99 J2.5
VALVE_POT  (via drill 0.4)
  Top 0.406: IC1.24 v42.7,8.58
  Top 0.61: v72.55,35.56 75.09,38.1 C16.2 R17.1
  Bottom 0.406: v42.7,8.58 45.08,6.19 46.99,6.19 49.37,8.57 65.88,8.57 66.99,9.68 66.99,30.8 66.04,31.75 66.04,34.92 66.67,35.56 J10.2
  Bottom 0.61: J10.2 v72.55,35.56

### Text on the board
tPlace: Power | +60V | HIGH | GND | IN | +5V | GND | !CS | MISO | SCK | PWM | +24V | LOW | FBACK | INDEX | !CS | +5V | R2020 | GND | I | ISP | 1 | +5V | PD6 | PD5 | SCK | STP | B | PC7 | A | GND | CAN | MOSI | DIR | TERM | D | U | CAN H | MISO | CAN L | SPI | S/D | . | . | Keep all jumpers | 5V | on same side | Out | Reset | Error | DTR | RXD | TXD | +5V | NC | GND | R2020 Servo Controller | Luke Weston, 2013